# Altium schematic sheet Sheet1.SchDoc
size A4; SheetNumber: 1; SheetTotal: 2
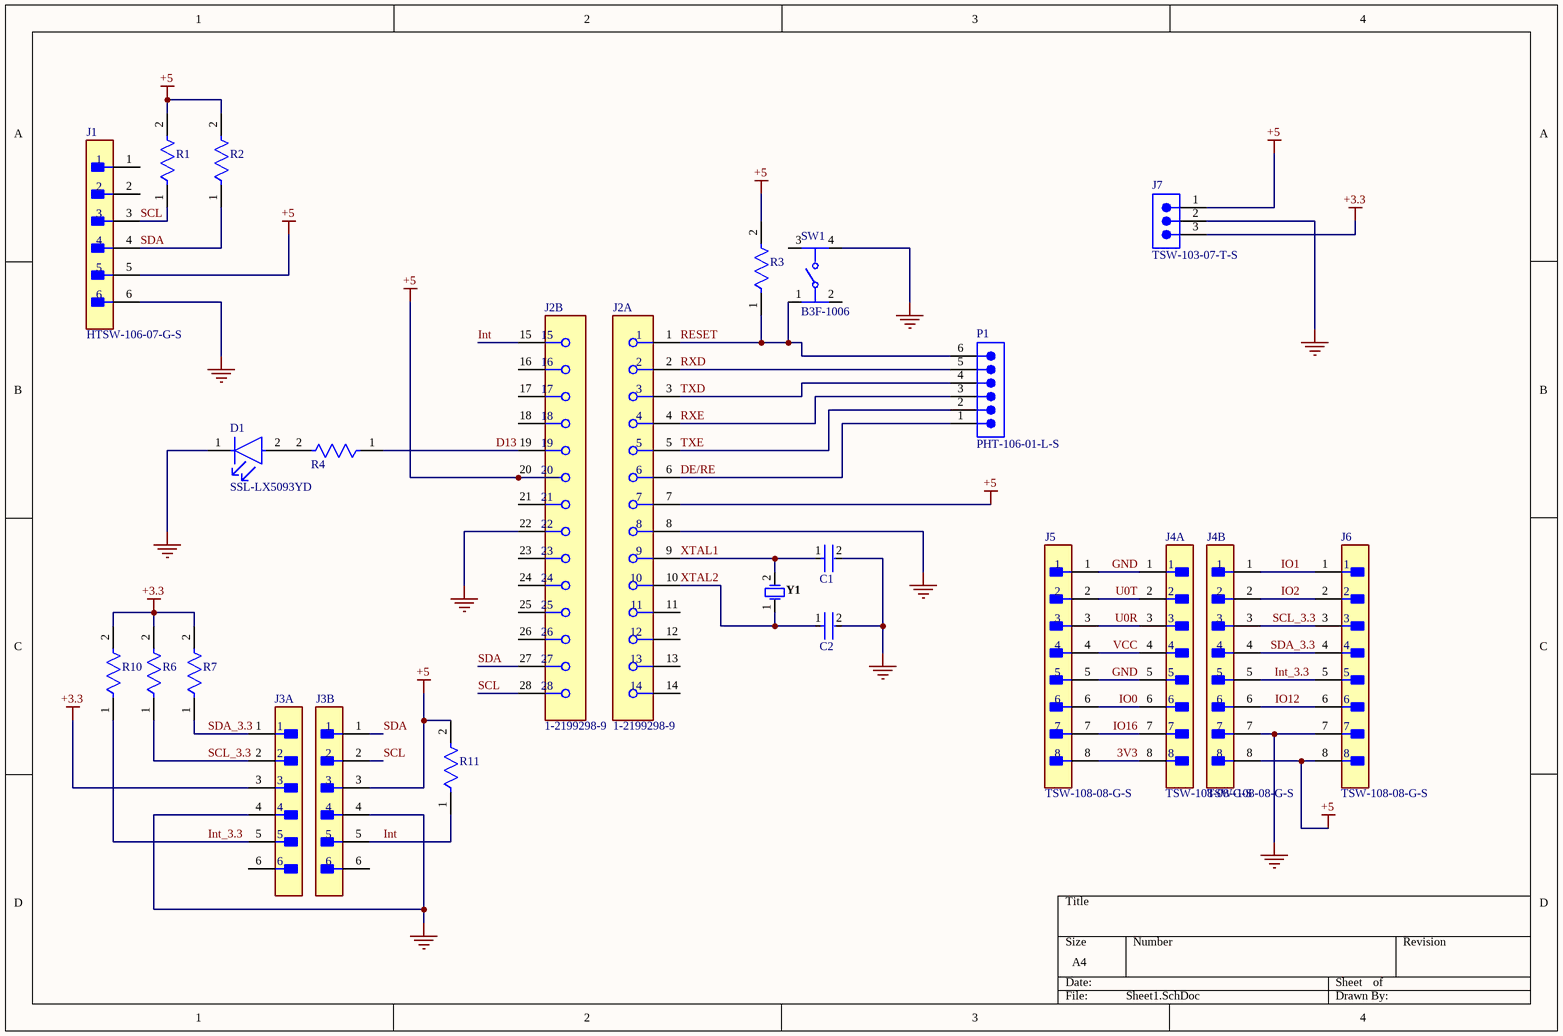
[diagram p0: Sheet1.SchDoc]

## Parts
C1  RCE5C1H220J0DBH03A  [FP-RCE0DB-MFG]  (value not drawn)
C2  RCE5C1H220J0DBH03A  [FP-RCE0DB-MFG]  (value not drawn)
D1  SSL-LX5093YD  [FP-SSL-LX5093YD-MFG]
J1  HTSW-106-07-G-S  [FP-HTSW-106-07-G-S-MFG]
J2  1-2199298-9  [FP-1-2199298-9-MFG]  (parts A,B of 2)
J3A  TSW-106-22-G-S  [FP-TSW-106-22-G-S-MFG]  (value not drawn)
J3B  TSW-106-22-G-S  [FP-TSW-106-22-G-S-MFG]  (value not drawn)
J4A  TSW-108-08-G-S  [FP-TSW-108-08-G-S-MFG]
J4B  TSW-108-08-G-S  [FP-TSW-108-08-G-S-MFG]
J5  TSW-108-08-G-S  [FP-TSW-108-08-G-S-MFG]
J6  TSW-108-08-G-S  [FP-TSW-108-08-G-S-MFG]
J7  TSW-103-07-T-S  [SMTC-TSW-103-07-X-S]
P1  PHT-106-01-L-S  [SMTC-PHT-106-01-X-S]
R1  VR37000001204JA100  [FP-VR37-MFG]  (value not drawn)
R2  VR37000001204JA100  [FP-VR37-MFG]  (value not drawn)
R3  VR37000001204JA100  [FP-VR37-MFG]  (value not drawn)
R4  VR37000001204JA100  [FP-VR37-MFG]  (value not drawn)
R6  VR37000001204JA100  [FP-VR37-MFG]  (value not drawn)
R7  VR37000001204JA100  [FP-VR37-MFG]  (value not drawn)
R10  VR37000001204JA100  [FP-VR37-MFG]  (value not drawn)
R11  VR37000001204JA100  [FP-VR37-MFG]  (value not drawn)
SW1  B3F-1006  [FP-B3F-1006-MFG]
Y1  FOXSLF/160-20  [FOX-FOXSLF160-20]  (value not drawn)

## Nets
+3.3: J3A.3 J7.3 R6.2 R7.2 R10.2
+5: J1.5 J2.7 J2.20 J3B.3 J4B.8 J6.8 J7.1 R1.2 R2.2 R3.2 R11.2
GND: C1.2 C2.2 D1.1(C) J1.6 J2.8 J2.22 J3A.4 J3B.4 J4A.1 J4A.5 J4B.7 J5.1 J5.5 J6.7 J7.2 SW1.4
3V3: J4A.8 J5.8
D13: J2.19 R4.1
DE/RE: J2.6 P1.1
Int: J2.15 J3B.5 R11.1
Int_3.3: J3A.5 J4B.5 J6.5 R10.1
IO0: J4A.6 J5.6
IO1: J4B.1 J6.1
IO2: J4B.2 J6.2
IO12: J4B.6 J6.6
IO16: J4A.7 J5.7
RESET: J2.1 P1.6 R3.1 SW1.1
RXD: J2.2 P1.5
RXE: J2.4 P1.3
SCL: J1.3 J2.28 J3B.2 R1.1
SCL_3.3: J3A.2 J4B.3 J6.3 R6.1
SDA: J1.4 J2.27 J3B.1 R2.1
SDA_3.3: J3A.1 J4B.4 J6.4 R7.1
TXD: J2.3 P1.4
TXE: J2.5 P1.2
U0R: J4A.3 J5.3
U0T: J4A.2 J5.2
VCC: J4A.4 J5.4
XTAL1: C1.1 J2.9 Y1.2
XTAL2: C2.1 J2.10 Y1.1
NetD1_2: D1.2(A) R4.2

Not connected (* = marked no-connect by the designer): J1 1 2; J2 11 12 13 14 16 17 18 21 23 24 25 26; J3A 6; J3B 6; SW1 2 3

## Library data of the parts
C1 C2 = CMP-06035-057691-1: Cap Ceramic 22pF 50V C0G ±5% Radial 2.5mm +125°C Ammo Pack; Lead Diameter: 0.5mm; Lead/Base Style: Straight; Termination: Radial; Height - Seated (Max): 0.138inch; Capacitance: 22pF; Height: 3.5mm; Dielectric: C0G; Voltage Rating (DC): 50V; Tolerance: 5%; Package Quantity: 2000; Max Operating Temperature: 125°C; Min Operating Temperature: -55°C; Packaging: Tape and Reel; Lead Pitch: 0.098inch; Mount: Through Hole; Length: 0.142inch; Voltage Rating: 50V; Resistor Type: Ceramic; Ratings: AEC-Q200; Case/Package: Radial; Width: 0.098inch
D1 = CMP-57192-000007-1: LED YELLOW DIFFUSED T-1 3/4 T/H; Test Current: 20mA; Number of LEDs: 1; Dominant Wavelength: 568nm; Wavelength: 585nm; Forward Voltage: 2.1V; Lens Style: Dome; Viewing Angle: 60°; Luminous Intensity: 30mcd; Min Operating Temperature: -40°C; Packaging: Bulk; Width: 1.5inch; Lead Free: Lead Free; Number of Pins: 2; Color: Yellow; Case/Package: Radial; Forward Current: 20mA; REACH SVHC: No SVHC; Lens Transparency: Diffused; Weight: 0.01lb; Height: 8.6mm; Package Quantity: 1000; Series: -; Length: 0.5inch; Illumination Color: Yellow; Mount: Through Hole; Diameter: 5mm; RoHS Compliant: Yes; Lens Color: Yellow; Max Operating Temperature: 85°C
J1 = CMP-02766-001515-1: CONN HEADER VERT 6POS 2.54MM; Number of Positions: 6; Pitch: 0.1inch; Max Voltage Rating (AC): 550V; Gender: Male; Max Current Rating: 7.6A; Contact Type: Male Pin; Contact Finish - Mating: GOLD; REACH SVHC: No SVHC; Number of Rows: 1; Insulation Material: Polymer; Housing Color: Natural; Connector Type: Header; Termination: Solder; Flammability Rating: UL94 V-0; Mount: Through Hole; Contact Shape: Square; Fastening Type: Pull; Max Operating Temperature: 125°C; Contact Material: Bronze; RoHS Compliant: Yes; Series: HTSW; Min Operating Temperature: -55°C; Contact Mating Length: 0.23inch; Orientation: Straight; Number of Contacts: 6; Depth: 2.48mm; Housing Material: Polymer; Insulation Color: Natural; Lead Free: Lead Free; Radiation Hardening: No; Length: 15.24mm; Contact Plating: Gold; Color: Natural; Packaging: Rail/Tube
J2 = CMP-03370-000006-1: CONN IC DIP SOCKET 28POS TIN; Pitch: 2.54mm; Insulation Resistance: 1GR; Number of Poles: 28; Contact Post Length: 3inch; Contact Current Rating: 1A; Connector Type: Pin; Mating Alignment: Yes (With); Row Spacing: 0.3inch; Orientation: Straight; ELV: Compliant; Termination: Through Hole; Mount: Through Hole; Package Quantity: 17; Contact Material: Bronze; Number of Rows: 2; Packaging: Rail/Tube; Contact Plating: Tin; Current Rating: 1A; Radiation Hardening: No; Min Operating Temperature: -40°C; Housing Material: PBT; Number of Contacts: 28; Color: Black; Max Operating Temperature: 105°C; Flammability Rating: UL94 V-0; Number of Positions: 28; Insulation Material: Thermoplastic; RoHS Compliant: Yes; Length: 1.4inch
J3A J3B = CMP-02766-000118-1: CONN HEADER VERT 6POS 2.54MM; Gender: Male; Number of Contacts: 6; REACH SVHC: No SVHC; Number of Rows: 1; Contact Material: Bronze; Contact Plating: Gold; Termination: Solder; Mount: Through Hole
J4A J4B J5 J6 = CMP-02766-000001-1: CONN HEADER VERT 8POS 2.54MM; Manufacturer: Samtec; Number Of Contacts: 8; Conn Orientation: Straight; Conn Gender: Male; Device Class L1: Connectors; ComponentLink2Description: Datasheet; Digikey Description: CONN HEADER VERT 8POS 2.54MM; ComponentLink2URL: http://suddendocs.samtec.com/catalog_english/tsw_th.pdf; Temperature: -55°C to +125°C; RoHS: TRUE; Mouser Description: TSW - Samtec 2.54mm Pin Header 13.46mm Overall Pin Length 5.08mm Tail; Automotive: No; Temperature Range High: +125°C; Package: TSW-108-08-G-S; Device Class L3: unset; Manufacturer Part Number: TSW-108-08-G-S; Pitch: 2.54mm; Number Of Rows: 1; Lead Free: Yes; Height: 8.71mm; Contact Material: Gold,Nickel; Footprint Url: http://suddendocs.samtec.com/prints/tsw-xxx-xx-x-x-xx-xxx-footprint.pdf; Temperature Range Low: -55°C; Octopart: https://octopart.com/tsw-108-08-g-s-samtec-272653; Category: Conn; Device Class L2: Headers and Wire Housings
J7 = CMP-1024-00332-1: 0.025" SQ Post Header, Through-hole, Vertical, -55 to 105 degC, 2.54 mm Pitch, 3-Pin, Male, RoHS; Manufacturer: Samtec; Pitch: 2.54 mm; ComponentLink1URL: http://www.samtec.com; ComponentLink3URL: http://www.samtec.com/documents/webfiles/cpdf/TSW-XXX-XX-XXX-X-XX-XXX-MKT.pdf; PartNumber: TSW-103-07-T-S; Mounting Technology: Through-hole; RoHS: True; DatasheetVersion: F-214; PackageVersion: DM, 8/1988; Temperature Range: -55 to 105 degC; ComponentLink2Description: Datasheet; ComponentLink1Description: Manufacturer URL; Orientation: Vertical; PackageReference: TSW-103-07-X-S; ComponentLink3Description: Package Specification; ComponentLink2URL: http://www.samtec.com/documents/webfiles/pdf/TSW_TH.PDF; PackageDescription: .025[0.64] SQ. Post Terminal Strip Assembly
P1 = CMP-1024-00187-1: Press Fit Header, Through-hole, Vertical, -55 to 125 degC, 2.54 mm Pitch, 6-Pin, Male, RoHS; Manufacturer: Samtec; Pitch: 2.54 mm; PackageReference: PHT-106-01-X-S; PackageDescription: .100 Press Fit Socket Assembly; ComponentLink3URL: http://www.samtec.com/documents/webfiles/cpdf/PHT-1XX-XX-X-X-XXX-MKT.pdf; PackageVersion: J, 9/2009; ComponentLink3Description: Package Specification; PartNumber: PHT-106-01-L-S; ComponentLink1Description: Manufacturer URL; Orientation: Vertical; Mounting Technology: Through-hole; ComponentLink1URL: http://www.samtec.com; ComponentLink2URL: http://www.samtec.com/documents/webfiles/pdf/pht.pdf; Temperature Range: -55 to 125 degC; RoHS: True; DatasheetVersion: F-214; ComponentLink2Description: Datasheet
R1-R4 R6 R7 R10 R11 = CMP-02408-000054-1: RES 1.2M OHM 5% 1/2W AXIAL; Voltage Rating: 3.5kV; Power Rating: 500mW; Temperature Coefficient: 200ppm/°C; Resistance: 1.2MR; Diameter: 4mm; Max Operating Temperature: 155°C; Military Standard: Not; Reach SVHC Compliant: Yes; Min Operating Temperature: -55°C; Resistance Tolerance: 5%; Resistor Type: Metal Film; Tolerance: 5%; Mount: Through Hole; Construction: Cylindrical; Contact Plating: Tin; Length: 10mm; Termination: Axial; Voltage Rating (DC): 3.5kV; Packaging: Ammo Pack; Radiation Hardening: No; Case/Package: Conformal
SW1 = CMP-08834-000047-1: SWITCH TACTILE SPST-NO 0.05A 24V; Mechanical Life: 50000Cycles; Operating Force: 4.9N; Actuator Length: 0.9mm; Illumination Type: Non-Illuminated; Actuator Type: Standard; Contact Current Rating: 50mA; Number of Poles: 1; Contact Resistance: 100mR; Throw Configuration: SPST; Ratings: IP00; Switch Travel: 0.25mm; Switch Function: Off-Mom; Actuator Color: Red; Orientation: Straight; Height: 4.3mm; Voltage Rating (DC): 24V; Contact Plating: Silver; Depth: 6mm; Width: 6mm; Series: B3F; Min Operating Temperature: -25°C; Length: 6mm; Packaging: Bag; Max Operating Temperature: 70°C; Max Voltage Rating (DC): 24V; Weight: 0.25g; Termination: PC Pins; Max Current Rating: 50mA; Package Quantity: 1500; Mount: Through Hole; Current Rating: 50mA; Lead Free: Lead Free; Contact Material: Gold; Electrical Life: 50000Cycles
Y1 = CMP-1749-00003-1: Resistance Weld Thru-Hole Crystal, 16 MHz, -20 to 70 degC, 2-Pin THD, RoHS, Bulk; Voltage Rating: 250 V; Tolerance: 1%; Resistance: 221 kohm; Case\Package: Axial; Power Rating: 250 mW; RoHSCompliant: true; Package Quantity: 200; Packaging: Bulk; Min Operating Temperature: -55 degC; DatasheetVersion: Mar-15; ComponentLink1URL: http://www.foxonline.com/; Max Operating Temperature: 155 degC; PackageReference: FOXSLF160-20; Mount: Through Hole; PackageDescription: 2-Pin Through Hole Device, Body 11.35 x 4.65 mm; ComponentLink1Description: Manufacturer URL; ComponentLink2URL: http://www.foxonline.com/pdfs/hc49slf.pdf; ComponentLink2Description: Datasheet; Length: 0.248 inch